# EAGLE design iSkipper.Ver.1.0.2 (EAGLE 9.0.1)
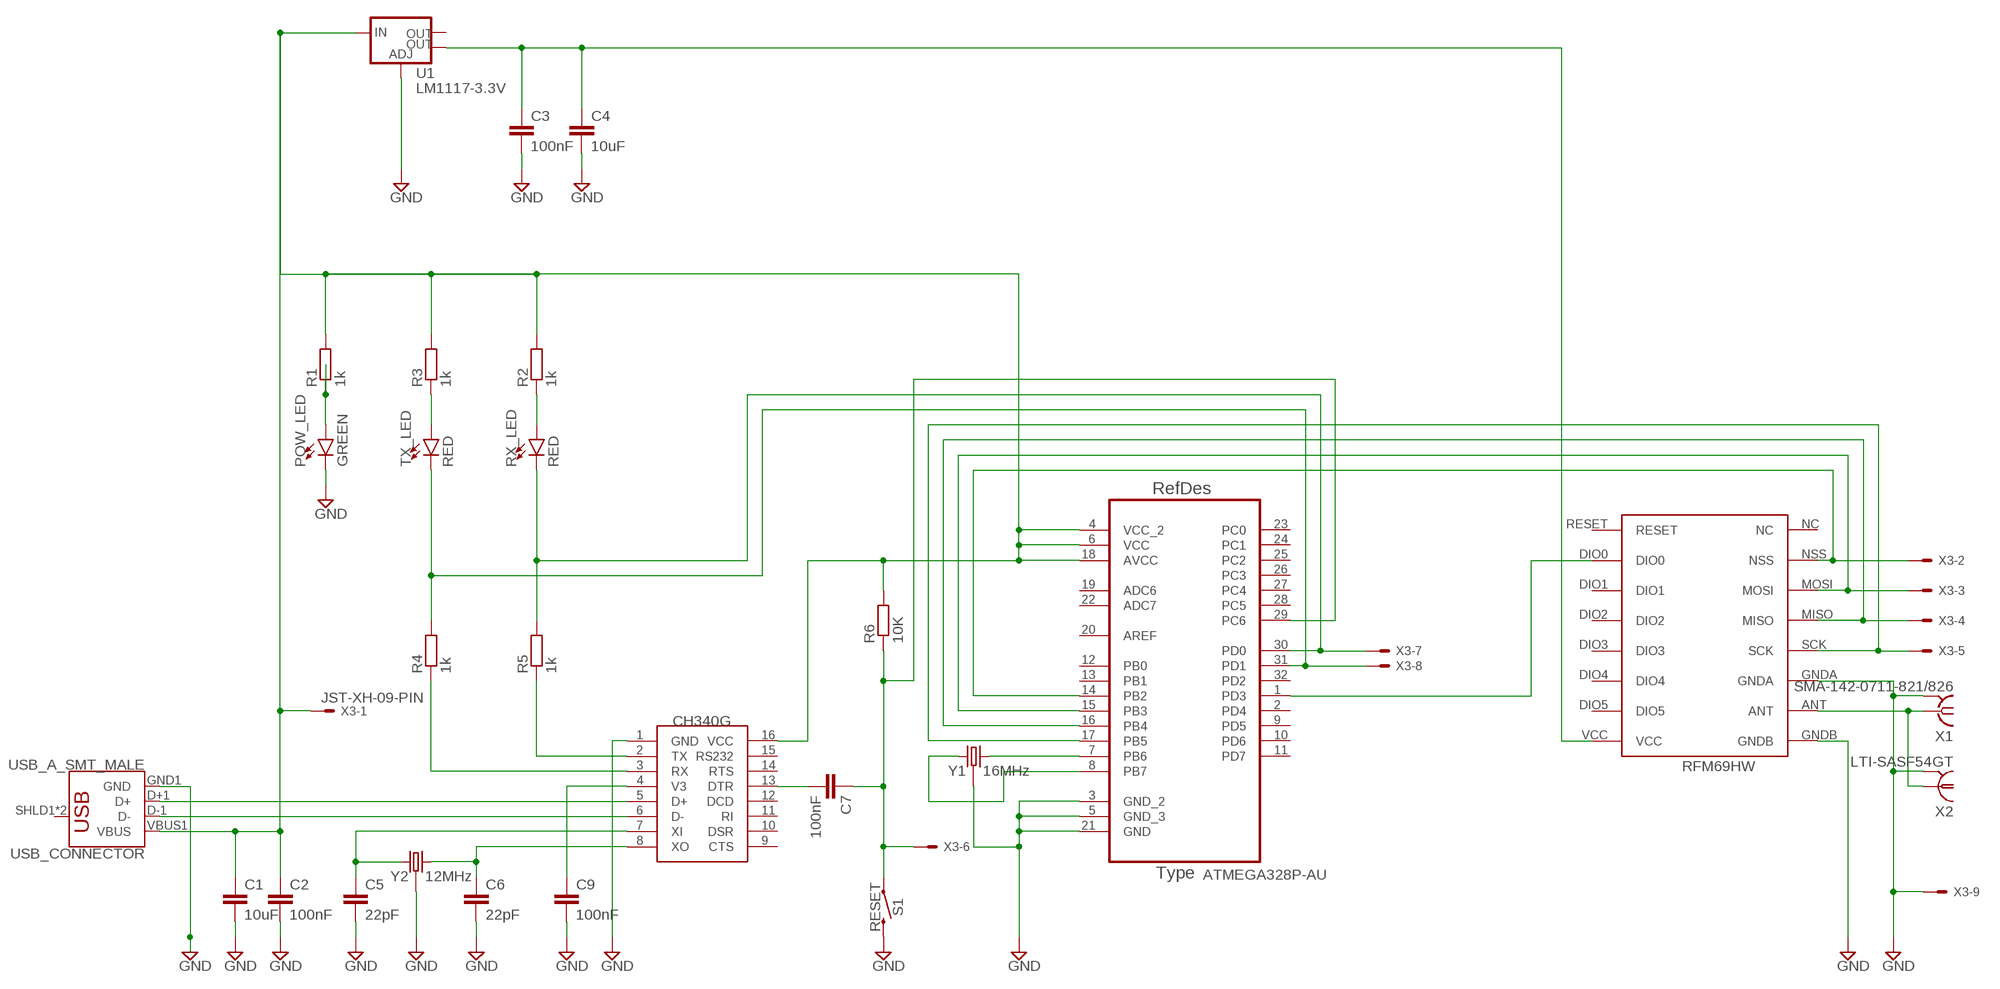
[diagram p0: schematic, sheet 1]

## Parts
ATMEGA328P  ATMEGA328P-AU  [QFP80P900X900X120-32N]
C1  10uF  CC1206  [C1206]
C2  100nF  CC1206  [C1206]
C3  100nF  C-EUC1206  [C1206]
C4  10uF  CC1206  [C1206]
C5  22pF  C-EUC1206  [C1206]
C6  22pF  C-EUC1206  [C1206]
C7  100nF  C-EUC1206  [C1206]
C9  100nF  CC1206  [C1206]
POW_LED  GREEN  LED-GREEN1206  [LED-1206]
R1  1k  RR1206  [R1206]
R2  1k  RR1206  [R1206]
R3  1k  RR1206  [R1206]
R4  1k  RR1206  [R1206]
R5  1k  RR1206  [R1206]
R6  10K  RR1206  [R1206]
RFM69HW  RFM69HW  [RFM]
RX_LED  RED  LED-RED1206  [LED-1206]
S1  RESET  MOMENTARY-SWITCH-SPST-SMD-5.2MM  [TACTILE_SWITCH_SMD_5.2MM]
TX_LED  RED  LED-RED1206  [LED-1206]
U1  LM1117-3.3V  V_REG_LM1117SOT223  [SOT223]
U$1  CH340G  [SOIC16]
USB_CONNECTOR  USB_A_SMT_MALE  [USB-A-SMT-MALE]
X1  SMA-142-0711-821/826  [J502-ND-142-0711-821/826]
X2  LTI-SASF54GT  [LTI-SASF54GT]
X3  JST-XH-09-PIN  [JST-XH-09-PACKAGE-ROUND-PAD-NO-SILK]
Y1  16MHz  CRYSTAL-GROUNDEDSMD-3.2X2.5  [CRYSTAL-SMD-3.2X2.5MM]
Y2  12MHz  CRYSTAL-GROUNDEDSMD-3.2X2.5  [CRYSTAL-SMD-3.2X2.5MM]

## Nets
GND [Ground]: ATMEGA328P.3(GND_2) ATMEGA328P.5(GND_3) ATMEGA328P.21(GND) C1.2 C2.2 C3.2 C4.2 C5.2 C6.2 C9.2 POW_LED.C RFM69HW.GNDA RFM69HW.GNDB S1.3 U1.1(ADJ) U$1.1(GND) USB_CONNECTOR.GND1(GND) X1.G@1 X1.G@2 X1.G@3 X1.G@4 X2.2 X2.3 X2.4 X2.5 X3.9 Y1.2 Y1.4 Y2.2 Y2.4
N$1: ATMEGA328P.7(PB6) Y1.3
N$2: ATMEGA328P.8(PB7) Y1.1
N$3 [+5.0V]: ATMEGA328P.4(VCC_2) ATMEGA328P.6(VCC) ATMEGA328P.18(AVCC) C1.1 C2.1 R1.2 R2.2 R3.2 R6.2 U1.3(IN) U$1.16(VCC) USB_CONNECTOR.VBUS1(VBUS) X3.1
N$5: U$1.5(D+) USB_CONNECTOR.D+1(D+)
N$6 [+3.3V]: C3.1 C4.1 RFM69HW.VCC U1.4(OUT)
N$7: POW_LED.A R1.1
N$8: R3.1 TX_LED.A
N$9: U$1.6(D-) USB_CONNECTOR.D-1(D-)
N$10: R2.1 RX_LED.A
N$11: R5.1 U$1.2(TX)
N$12: C6.1 U$1.8(XO) Y2.3
N$13: C5.1 U$1.7(XI) Y2.1
N$14: R4.1 U$1.3(RX)
N$15: ATMEGA328P.31(PD1) R4.2 TX_LED.C X3.8
N$16: ATMEGA328P.30(PD0) R5.2 RX_LED.C X3.7
N$17: C7.2 U$1.13(DTR)
N$18: ATMEGA328P.29(PC6) C7.1 R6.1 S1.1 X3.6
N$19: RFM69HW.ANT X1.1 X2.1
N$20: C9.1 U$1.4(V3)
N$22: ATMEGA328P.17(PB5) RFM69HW.SCK X3.5
N$23: ATMEGA328P.1(PD3) RFM69HW.DIO0
N$24: ATMEGA328P.14(PB2) RFM69HW.NSS X3.2
N$25: ATMEGA328P.16(PB4) RFM69HW.MISO X3.4
N$26: ATMEGA328P.15(PB3) RFM69HW.MOSI X3.3
Unconnected: ATMEGA328P.2(PD4) ATMEGA328P.9(PD5) ATMEGA328P.10(PD6) ATMEGA328P.11(PD7) ATMEGA328P.12(PB0) ATMEGA328P.13(PB1) ATMEGA328P.19(ADC6) ATMEGA328P.20(AREF) ATMEGA328P.22(ADC7) ATMEGA328P.23(PC0) ATMEGA328P.24(PC1) ATMEGA328P.25(PC2) ATMEGA328P.26(PC3) ATMEGA328P.27(PC4) ATMEGA328P.28(PC5) ATMEGA328P.32(PD2) RFM69HW.DIO1 RFM69HW.DIO2 RFM69HW.DIO3 RFM69HW.DIO4 RFM69HW.DIO5 RFM69HW.NC RFM69HW.RESET U1.2(OUT) U$1.9(CTS) U$1.10(DSR) U$1.11(RI) U$1.12(DCD) U$1.14(RTS) U$1.15(RS232) USB_CONNECTOR.SHLD1(SHIELD) USB_CONNECTOR.SHLD2(SHIELD)

## Library data of the parts
ATMEGA328P = Atmel-ATMEGA328P-AU:ATMEGA328P-AU; DESCRIPTION: 8-bit Microcontroller with In-System Programmable Flash; MPN: ATMEGA328P-AU; OC_FARNELL: 1715486; OC_NEWARK: 14R4631; PACKAGE: TQFP-32; SUPPLIER: Atmel
C1 C2 C4 C9 = eagle-ltspice:C: CAPACITOR, European symbol; SPICEMODEL: NONE; SPICEPREFIX: C
C3 C7 = rcl:C-EU: CAPACITOR, European symbol; SPICEPREFIX: C
C5 C6 = resistor:C-EU: CAPACITOR, European symbol
POW_LED = SparkFun-LED:LED-GREEN: Green SMD LED Used in manufacturing of various products at SparkFun Packages: 0603 - SMD 0603 package [Product Link] <http://www.futureelectronics.com/en/technologies/semiconductors/optoelectronics/leds/Pages/9894312-LTST-C190GKT.aspx?CrossPart=HSMG-C190&IM=0> LilyPad 1206 - SMD1206 LilyPad package [Product Link] <http://www.futureelectronics.com/en/Technologies/Product.aspx?ProductID=IN150NGHARVATEKCORPORATION2049943&IM=0> 1206 - SMD1206 package [Product Link] <http://www.futureelectronics.com/en/technologies/semiconductors/optoelectronics/leds/Pages/8315665-LTST-C150KGKT.aspx?IM=0> 1206 Bottom Mount -SMD 1206 Bottom Mount [Product Link] <http://www.digikey.com/product-detail/en/lite-on-inc/LTST-C230KGKT/160-1456-1-ND/386854> SparkFun Products: Pro Mini 328 -5V <https://www.sparkfun.com/products/821> RedBoard <https://www.sparkfun.com/products/12757> MP3 Trigger <https://www.sparkfun.com/products/13720> Makey Makey <https://www.sparkfun.com/products/11076>; PROD_ID: DIO-00862
R1-R6 = eagle-ltspice:R: RESISTOR, European symbol; SPICEMODEL: NONE; SPICEPREFIX: R
RFM69HW = hoperf:RFM69HW; TYPE: RFM69HW
RX_LED TX_LED = SparkFun-LED:LED-RED: Red SMD LED Used in manufacturing of most products at SparkFun Packages: 0603 - SMD 0603 package [Product Link] <http://docs.avagotech.com/docs/AV02-0551EN> 0603 SMART - SMD 0603 SMART package ( more efficient and expensive)[Product Link] <http://www.osram-os.com/Graphics/XPic2/00077099_0.pdf> 1206 - SMD1206 package [Product Link] <https://www.sparkfun.com/datasheets/DevTools/LilyPad/Q150OVS4.pdff> SparkFun Products: Pro Mini 328 -5V <https://www.sparkfun.com/products/821> RedBoard <https://www.sparkfun.com/products/12757> IOIO-OTG <https://www.sparkfun.com/products/13613>; PROD_ID: DIO-09912
S1 = SparkFun-Switches:MOMENTARY-SWITCH-SPST: Momentary Switch (Pushbutton) - SPST Normally-open (NO) SPST momentary switches (buttons, pushbuttons). Variants PTH-12MM - 12mm square, through-hole Momentary Pushbutton Switch - 12mm Square <https://www.sparkfun.com/products/9190> (COM-09190) PTH-6.0MM, PTH-6.0MM-KIT - 6.0mm square, through-hole Mini Pushbutton Switch <https://www.sparkfun.com/products/97> (COM-00097) KIT package intended for soldering kit's - only one side of pads' copper is exposed. PTH-RIGHT-ANGLE-KIT - Right-angle, through-hole Right Angle Tactile Button <https://www.sparkfun.com/products/10791> - Used on SparkFun BigTime Watch Kit <https://www.sparkfun.com/products/11734> SMD-12MM - 12mm square, surface-mount Tactile Button - SMD (12mm) <https://www.sparkfun.com/products/12993> (COM-12993) Used on SparkFun PicoBoard <https://www.sparkfun.com/products/11888> SMD-4.5MM - 4.5mm Square Trackball Switch Used on SparkFun Blackberry Trackballer Breakout <https://www.sparkfun.com/products/13169> SMD-4.6MMX2.8MM - 4.60mm x 2.80mm, surface mount Used on SparkFun SAMD21 Mini Breakout <https://www.sparkfun.com/products/13664> SMD-5.2MM, SMD-5.2-REDUNDANT - 5.2mm square, surface-mount Mini Pushbutton Switch - SMD <https://www.sparkfun.com/products/8720> (COM-08720) Used on Arduino Pro Mini <https://www.sparkfun.com/products/11114> REDUNDANT package connects both switch circuits together SMD-6.0X3.5MM - 6.0 x 3.5mm, surface mount Momentary Reset Switch SMD <https://www.sparkfun.com/products/8229> (COM-08229) SMD-6.2MM-TALL - 6.2mm square, surface mount Tactile Button - SMD (6mm) <https://www.sparkfun.com/products/12992> Used on SparkFun Digital Sandbox <https://www.sparkfun.com/products/12651> SMD-RIGHT-ANGLE - Right-angle, surface mount Used on SparkFun Block for Intel® Edison - Arduino <https://www.sparkfun.com/products/13036>; PROD_ID: SWCH-08247; SF_SKU: COM-08720
U1 = SparkFun-IC-Power:V_REG_LM1117: Voltage Regulator LM1117 Standard adjustable voltage regulator but in SMD form. Spark Fun Electronics SKU : COM-00595; PROD_ID: VREG-08170
U$1 = ch340g:CH340G
USB_CONNECTOR = SparkFun-Connectors:USB_A: USB-A Connector Male and female variants, as well as PTH and SMT variants SparkFun Products: SparkFun XBee Explorer Dongle <https://www.sparkfun.com/products/11697> PTH Male SparkFun MicroView-USB Programmer <https://www.sparkfun.com/products/12924> SMT Male SparkFun USB Type A Female Breakout <https://www.sparkfun.com/products/12700> SMT Female; PROD_ID: CONN-11499
X1 = con-coax:SMA-: SMA 50 Ohm End Launch Jack Receptacle - Round Contact Johnson Components Source: www.johnsoncomponents.com .. J502-ND.pdf; MF: JOHNSON COMPONENTS; MPN: 142-0711-821; OC_FARNELL: 1019328; OC_NEWARK: 16F3627
X2 = con-coax:LTI-SASF54GT: SMA vertical PCB thrue hole jack Source: Lighthorse Technologies, inc. SASF54GT.pdf; OC_FARNELL: unknown; OC_NEWARK: unknown
X3 = Rembrandt Electronics - JST XH Connectors v1-0:JST-XH-09-PIN: JST XH Connector 2 Pin Wire to board connector. Pitch: 2,54 mm, (0.100") Number of pins: 9 Created by Rembrandt Electronics www.rembrandtelectronics.com
Y1 Y2 = SparkFun-Clocks:CRYSTAL-GROUNDED: Crystals w/ Ground Pin (Generic) These are passive quartz crystals, which can be used as a clock source for a microcontroller. Crystal's are usually two-terminal devices. A third terminal may be optionally connected to ground, as recommended by the manufaturer.

## Board
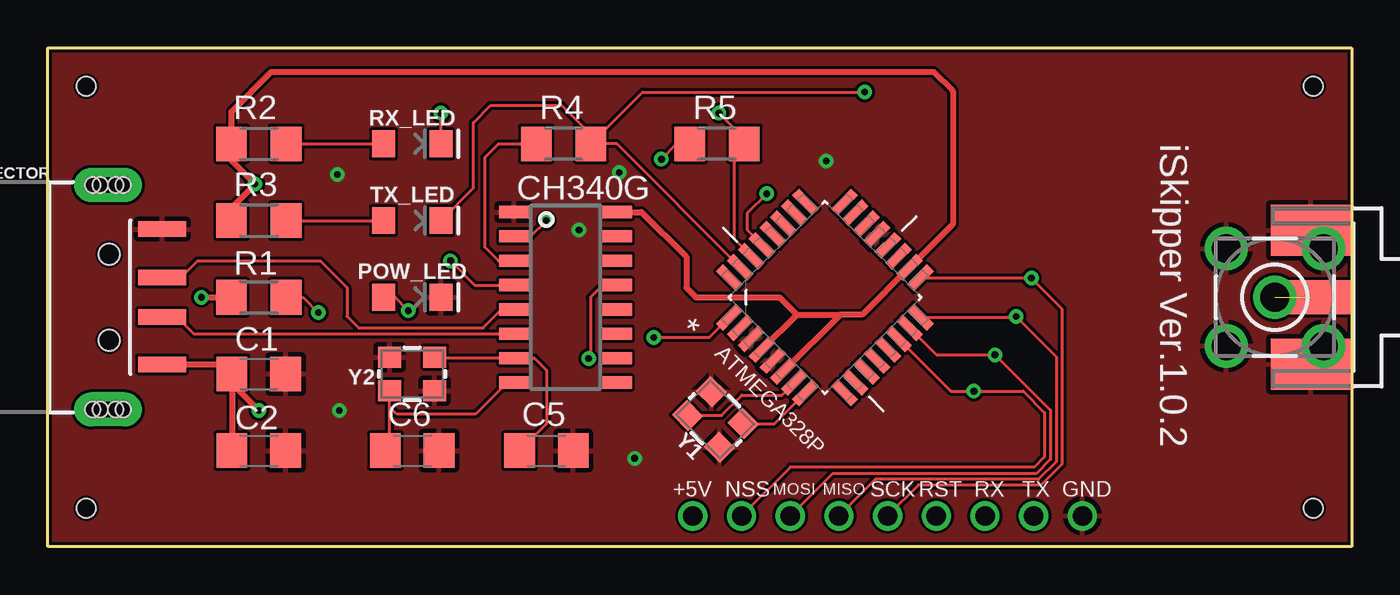
[diagram p1: board, top side]
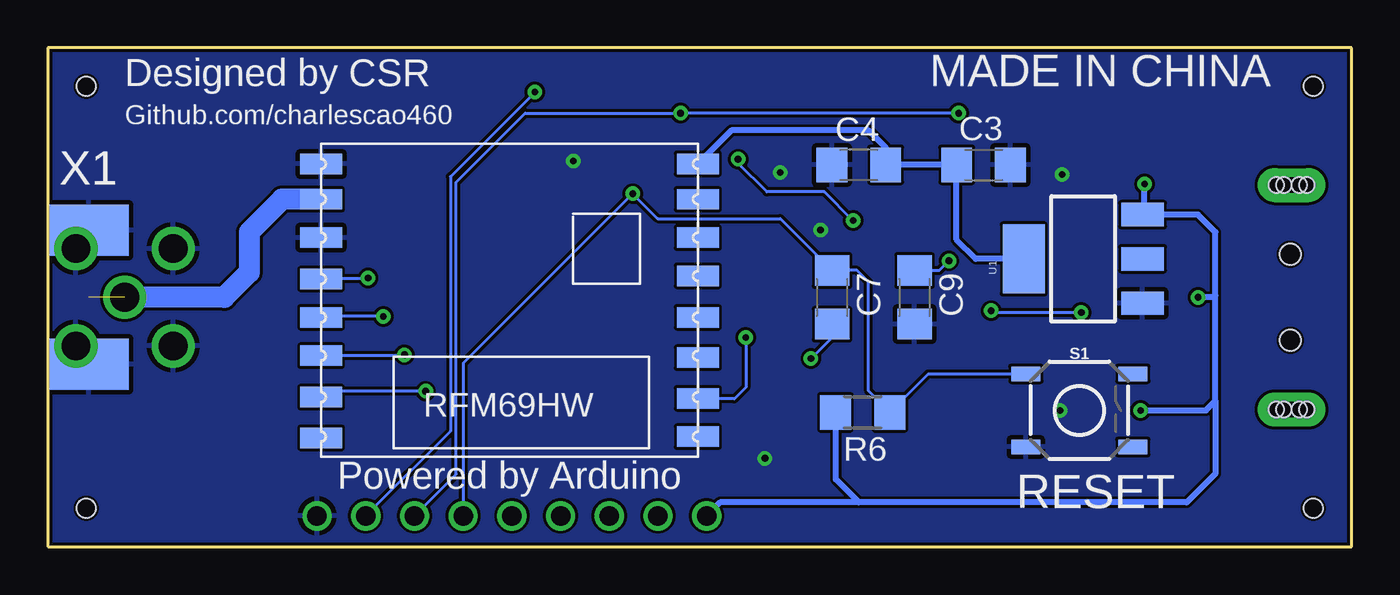
[diagram p2: board, bottom side, seen from below]

Size 68 x 26 mm. Coordinates in mm from the lower left corner, seen from the top.
Outline: 0,0 0,26 68,26 68,0 0,0
Copper layers (1*16): Top 0.035mm / dielectric 1.5mm / Bottom 0.035mm
Design rules "default *": minimum track width 6mil, minimum drill 0.35mm, track to track 6mil, track to pad 6mil, pad to pad 6mil, via to via 6mil, smd to smd 6mil, copper to edge 6mil, drill to drill 6mil, minimum pad ring 10mil, minimum via ring 8mil, stop-mask expansion 4mil, vias tented up to drill 30mil, thermal gap 10mil
Holes 1 mm at 2,24 2,2 66,24 66,2

### Footprints (pad centres in the part's own frame; a part is rotated, then mirrored left to right if it is on the bottom)
QFP80P900X900X120-32N = smd 1.473 x 0.508: 1 -4.242,2.794; 2 -4.242,2.007; 3 -4.242,1.194; 4 -4.242,0.406; 5 -4.242,-0.406; 6 -4.242,-1.194; 7 -4.242,-2.007; 8 -4.242,-2.794; 17 4.242,-2.794; 18 4.242,-2.007; 19 4.242,-1.194; 20 4.242,-0.406; 21 4.242,0.406; 22 4.242,1.194; 23 4.242,2.007; 24 4.242,2.794 | smd 0.508 x 1.473: 9 -2.794,-4.242; 10 -2.007,-4.242; 11 -1.194,-4.242; 12 -0.406,-4.242; 13 0.406,-4.242; 14 1.194,-4.242; 15 2.007,-4.242; 16 2.794,-4.242; 25 2.794,4.242; 26 2.007,4.242; 27 1.194,4.242; 28 0.406,4.242; 29 -0.406,4.242; 30 -1.194,4.242; 31 -2.007,4.242; 32 -2.794,4.242
C1206 = smd 1.6 x 1.8: 1 -1.4,0; 2 1.4,0
LED-1206 = smd 1.2 x 1.4: A -1.5,0; C 1.5,0
R1206 = smd 1.6 x 1.803: 1 -1.422,0; 2 1.422,0
RFM = smd 2.184 x 1.067: ANT 19.651,2.889; DIO0 0,13.27; DIO1 0,11.143; DIO2 0,9.047; DIO3 0,6.889; DIO4 0,4.889; DIO5 0,2.889; GNDA 19.651,4.889; GNDB 19.651,1.048; MISO 19.651,9.047; MOSI 19.651,11.047; NC 19.651,15.334; NSS 19.651,13.206; RESET 0,15.27; SCK 19.651,7.048; VCC 0,1.048
TACTILE_SWITCH_SMD_5.2MM = smd 1.524 x 0.762: 1 -2.794,1.905; 2 2.794,1.905; 3 -2.794,-1.905; 4 2.794,-1.905
SOT223 = smd 1.219 x 2.235: 1 -2.311,-3.099; 2 0,-3.099; 3 2.311,-3.099 | smd 3.6 x 2.2: 4 0,3.099
SOIC16 = smd 0.635 x 1.524: 1 -4.445,-2.695; 2 -3.175,-2.695; 3 -1.905,-2.695; 4 -0.635,-2.695; 5 0.635,-2.695; 6 1.905,-2.695; 7 3.175,-2.695; 8 4.445,-2.695; 9 4.445,2.695; 10 3.175,2.695; 11 1.905,2.695; 12 0.635,2.695; 13 -0.635,2.695; 14 -1.905,2.695; 15 -3.175,2.695; 16 -4.445,2.695
USB-A-SMT-MALE = smd 2.5 x 0.8: D+1 10.95,1.027; D-1 10.95,-1.027; GND1 10.95,3.551; VBUS1 10.95,-3.5 | drill 0.8 pad 1.778 long: SHLD1 8.13,-5.85; SHLD2 8.13,5.85 | hole 1.1: 8.2,2.25; 8.2,-2.25 | hole 0.8: 8.53,-5.85; 8.93,-5.85; 7.73,-5.85; 7.33,-5.85; 8.53,5.85; 8.93,5.85; 7.73,5.85; 7.33,5.85
J502-ND-142-0711-821/826 = smd 4.191 x 1.778: 1 2.115,0 | smd 4.191 x 2.667: G@1 2.115,3.495; G@2 2.115,-3.495 | smd 4.191 x 2.667 bottom: G@3 2.115,3.495; G@4 2.115,-3.495
LTI-SASF54GT = drill 1.5 pad 2.2: 1 0,0; 2 -2.54,2.54; 3 2.54,2.54; 4 2.54,-2.54; 5 -2.54,-2.54
JST-XH-09-PACKAGE-ROUND-PAD-NO-SILK = drill 1.016: 1 -10.16,0; 2 -7.62,0; 3 -5.08,0; 4 -2.54,0; 5 0,0; 6 2.54,0; 7 5.08,0; 8 7.62,0; 9 10.16,0
CRYSTAL-SMD-3.2X2.5MM = smd 1.2 x 1.1: 1 -1.175,-0.875; 2 1.175,-0.875; 3 1.175,0.875; 4 -1.175,0.875

### Placement (x,y rotation side)
ATMEGA328P  40.53,12.99 45 top
C1  11,9 0 top
C2  11,5 0 top
C3  19.2,19.9 0 bottom
C4  25.7,19.9 180 bottom
C5  26,5 0 top
C6  19,5 0 top
C7  27.1,13 270 bottom
C9  22.8,13 270 bottom
POW_LED  19,13 0 top
R1  11,13 180 top
R2  11,21 180 top
R3  11,17 180 top
R4  26.9,21 0 top
R5  34.9,21 0 top
R6  25.5,7 180 bottom
RFM69HW  34.1,21 180 bottom
RX_LED  19,21 0 top
S1  14.2,7.1 0 bottom
TX_LED  19,17 0 top
U1  14,15 90 bottom
U$1  27,13 270 top
USB_CONNECTOR  -5,13 0 top
X1  68,13 180 top
X2  64,13 0 top
X3  43.8,1.6 0 top
Y1  34.81,6.62 135 top
Y2  19,9 180 top

### Tracks (layer width: path | path; a pad name or v marks a point on that pad's centre or on a via)
GND  (via drill 0.35)
  other vias: 15.1,19.4 15.2,7.1 40.6,20.1 30.6,4.6 29.8,19.5 27.7,16.5
  pour Top (rank 6): -1,28 -1,-1 69,-1 69,28
  pour Bottom (rank 6): -2,29 -2,-2 70,-2 70,29
N$1
  Top 0.152: Y1.3 35.14,6.84 36.2,7.9 38.28,7.9 ATMEGA328P.7
N$2
  Top 0.152: Y1.1 37.9,6.41 ATMEGA328P.8
N$3  (via drill 0.35)
  Top 0.305: USB_CONNECTOR.VBUS1 9.1,9.5 C1.1 | C1.1 C2.1 | 41.33,12.1 ATMEGA328P.6 | 41.33,12.1 42.48,12.1 ATMEGA328P.18 44.97,14.57 47.2,16.8 47.2,23.76 46.2,24.76 11.65,24.76 9.58,22.68 R2.2 9.58,20.12 v10.8,18.9 9.58,17.68 R3.2 | 39.06,12.1 41.33,12.1 | C1.1 9.6,8.5 v11,7.1 | U$1.16 30.95,17.45 33.3,15.1 33.3,13.5 33.8,13 38.16,13 39.06,12.1 | v8,13 R1.2 | ATMEGA328P.4 39.06,12.1
  Bottom 0.305: v11,7.1 7.6,7.1 7.1,7.6 | 7.1,7.6 7.1,13.1 | 7.1,13.1 7.1,16.4 8.01,17.31 U1.3 10.8,17.41 v10.8,18.9 | 7.1,7.6 7.1,3.8 8.6,2.3 25.7,2.3 | 25.7,2.3 26.9,3.5 26.9,6.98 R6.2 | 7.1,13.1 7.2,13 v8,13 | 25.7,2.3 32.94,2.3 X3.1
N$5
  Top 0.152: USB_CONNECTOR.D+1 6.93,14.03 7.8,14.9 14.2,14.9 15.6,13.5 15.6,12 16.2,11.41 22.7,11.41 23.66,12.36 U$1.5
N$6
  Bottom 0.305: U1.4 19.6,15 20.6,16 C3.1 C4.1 24.3,20.8 25.2,21.7 32.35,21.7 RFM69HW.VCC
N$7  (via drill 0.35)
  Top 0.152: R1.1 13.3,13 v14.1,12.2 | v18.8,12.3 18.1,13 POW_LED.A
  Bottom 0.152: v14.1,12.2 18.7,12.2 v18.8,12.3
N$8
  Top 0.152: R3.1 TX_LED.A
N$9
  Top 0.152: USB_CONNECTOR.D-1 6.73,11.97 7.6,11.1 U$1.6
N$10
  Top 0.152: R2.1 RX_LED.A
N$11  (via drill 0.35)
  Top 0.152: U$1.2 25.18,16.18 v26,17 | v32,20.2 32.8,21 R5.1
  Bottom 0.152: v26,17 27.5,18.5 30.5,18.5 32,20 v32,20.2
N$12
  Top 0.152: U$1.8 23.95,8.55 22.3,6.9 18.2,6.9 17.82,7.27 | C6.1 17.82,5.23 17.82,7.27 | Y2.3 17.82,7.6 17.82,7.27
N$13
  Top 0.152: Y2.1 20.23,9.82 U$1.7 25.38,9.82 26,9.2 26,6.4 C5.1
N$14
  Top 0.152: U$1.3 23.61,14.91 23.6,14.9 23.5,14.9 22.8,15.6 22.8,20.3 23.5,21 R4.1
N$15  (via drill 0.35)
  Top 0.152: ATMEGA328P.31 29.68,21 28.6,21 | 28.6,21 R4.2 31.02,23.7 v42.6,23.7 | 20.7,17 TX_LED.C 22.2,18.7 22.2,22.1 23.1,23 26.8,23 28.6,21.2 28.6,21
  Bottom 0.152: v42.6,23.7 47.01,19.3 47.01,6.02 X3.8
N$16  (via drill 0.35)
  Top 0.152: ATMEGA328P.30 35.8,16.03 35.8,20.48 R5.2 36.32,21.28 v35,22.6 | RX_LED.C v20.5,22.6
  Bottom 0.152: v20.5,22.6 v35,22.6 43.1,22.6 46.7,19 46.7,3.78 X3.7
N$17  (via drill 0.35)
  Top 0.152: U$1.13 28.93,13.64 28.3,13 28.3,9.8 v28.2,9.8
  Bottom 0.152: v28.2,9.8 27.1,10.9 C7.2
N$18  (via drill 0.35)
  Top 0.152: ATMEGA328P.29 37.24,15.76 36.5,16.5 36.5,17.4 v37.5,18.4
  Bottom 0.152: S1.1 22.07,9 R6.1 25.2,8.12 25.2,13.8 25.8,14.4 C7.1 29.8,17.1 36.2,17.1 v37.5,18.4 46.34,9.56 X3.6
N$19  (1 unrouted)
  Bottom 1.1: RFM69HW.ANT 55.79,18.11 57.5,16.4 57.5,14.3 58.8,13 X2.1
N$20  (via drill 0.35)
  Top 0.152: v21,14.9 22.27,13.64 U$1.4
  Bottom 0.152: C9.1 21.5,14.4 v21,14.9
N$22  (via drill 0.35)
  Top 0.152: ATMEGA328P.17 51.29,14.01 v51.3,14 52.9,12.4 52.9,4.3 51.8,3.2 45.4,3.2 X3.5
  Bottom 0.152: v51.3,14 51.35,13.95 RFM69HW.SCK
N$23  (via drill 0.35)
  Top 0.152: ATMEGA328P.1 34.49,10.9 v31.6,10.9
  Bottom 0.152: v31.6,10.9 31.6,8.3 32.2,7.7 33.4,7.7 33.5,7.6 33.97,7.6 RFM69HW.DIO0
N$24  (via drill 0.35)
  Top 0.152: X3.2 38.73,4.15 51.45,4.15 51.95,4.65 51.99,4.68 51.99,6.98 50.87,8.1 v48.3,8.1 47.11,8.1 ATMEGA328P.14
  Bottom 0.152: v48.3,8.1 53.45,8.1 RFM69HW.NSS
N$25  (via drill 0.35)
  Top 0.152: ATMEGA328P.16 50.47,11.97 v50.5,12 52.59,9.91 52.59,4.43 51.67,3.51 43.16,3.51 X3.4
  Bottom 0.152: v50.5,12 53.7,12 RFM69HW.MISO
N$26  (via drill 0.35)
  Top 0.152: ATMEGA328P.15 46.36,10 v49.4,10 52.29,7.11 52.29,4.55 51.55,3.81 42.4,3.81 42.31,3.81 40.93,3.81 X3.3
  Bottom 0.152: v49.4,10 49.45,9.95 RFM69HW.MOSI

### Text on the board
tNames: iSkipper Ver.1.0.2 | +5V | NSS | MOSI | MISO | SCK | RST | RX | TX | GND
bNames: MADE IN CHINA | Designed by CSR | Github.com/charlescao460 | Powered by Arduino | RESET